# EAGLE design battery_charger (EAGLE 4.09)
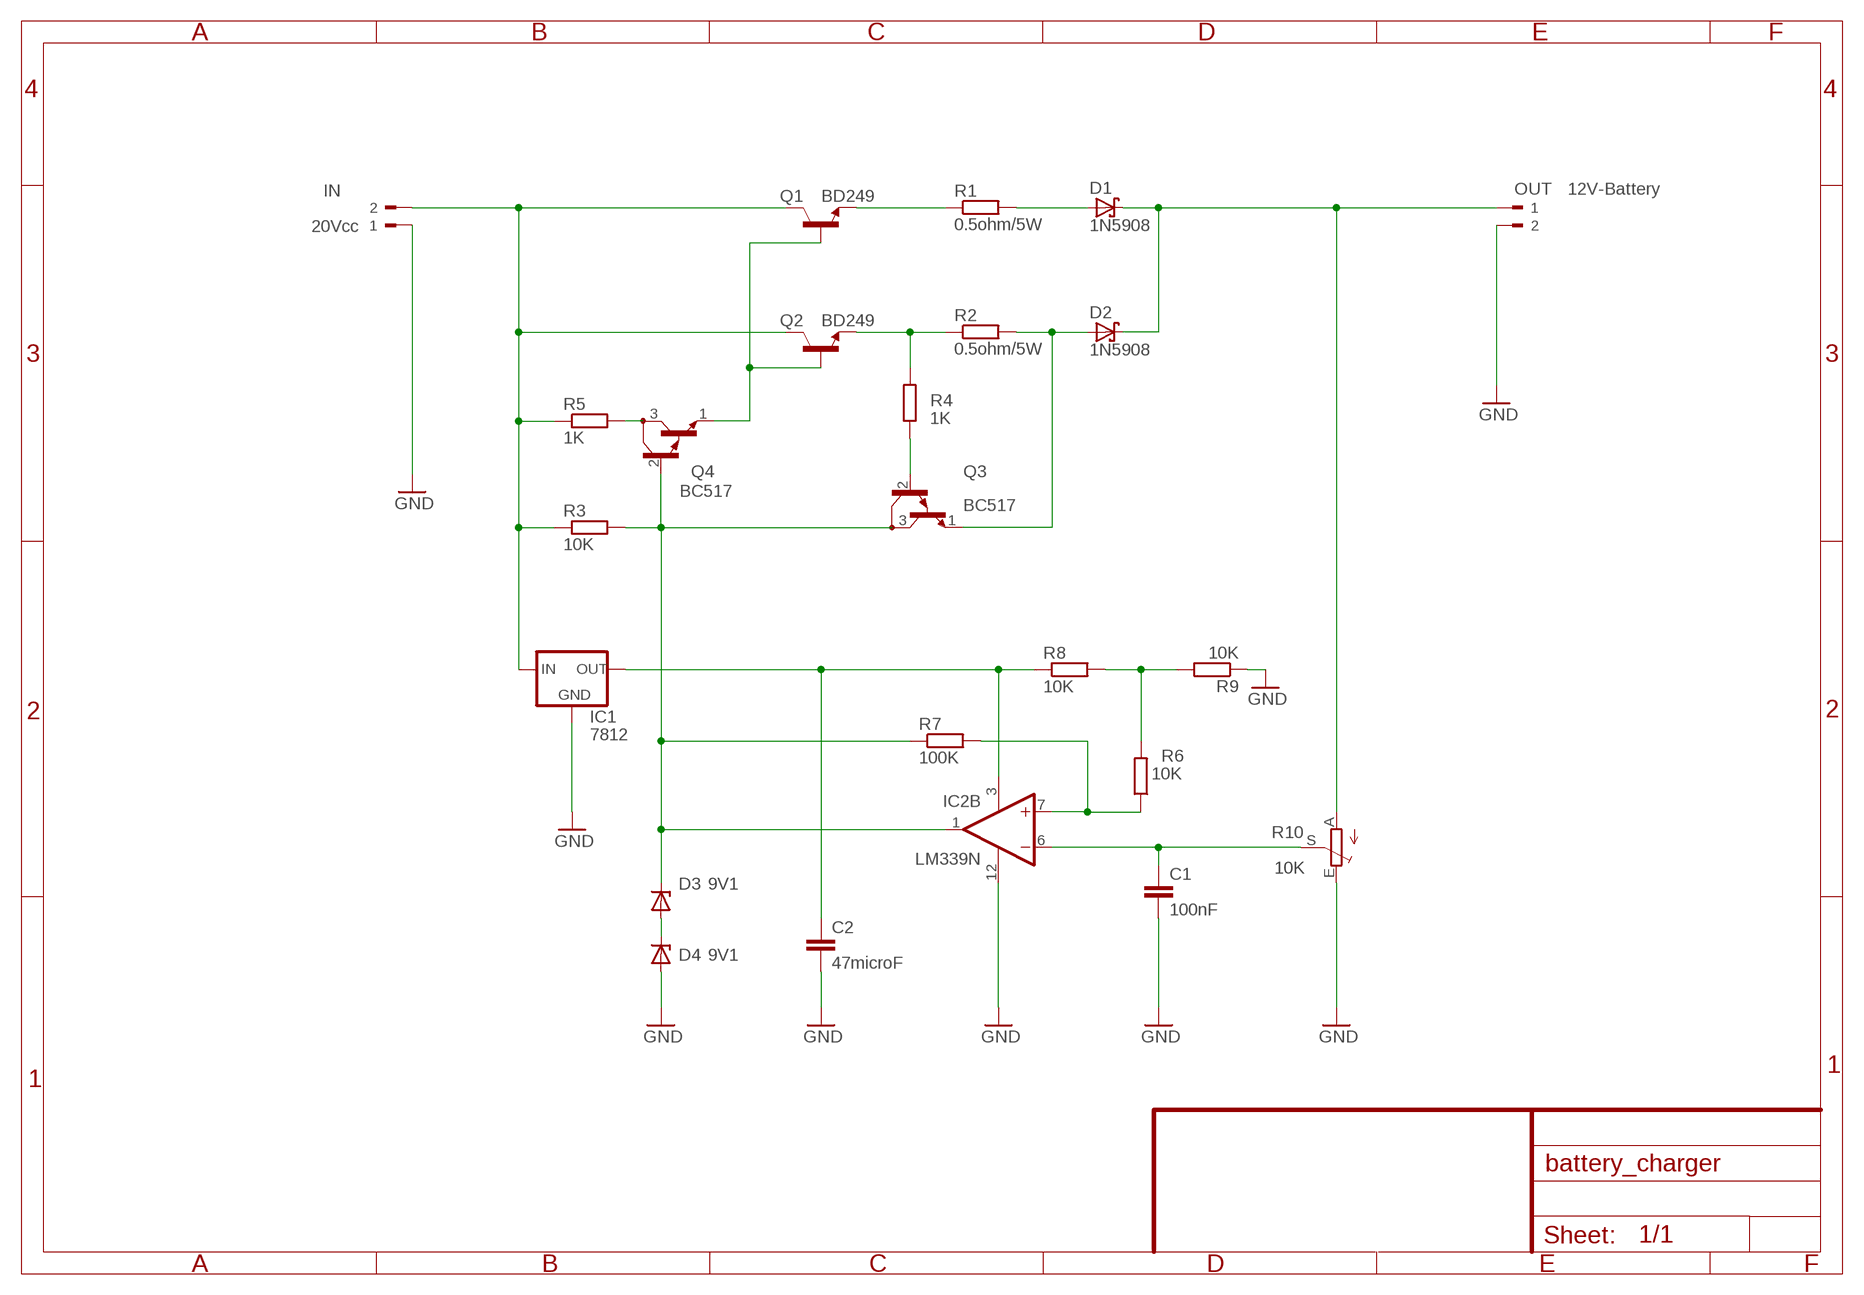
[diagram p0: schematic, sheet 1]

## Parts
C1  100nF  C-EU075-032X103  [C075-032X103]
C2  47microF  C-EU050-045X075  [C050-045X075]
D1  1N5908  [C4111-15]
D2  1N5908  [C4111-15]
D3  9V1  ZENER-DIODEDO34-7  [DO34Z7]
D4  9V1  ZENER-DIODEDO34-7  [DO34Z7]
IC1  7812  78XXS  [78XXS]
IC2  LM339N  [DIL14]
IN  20Vcc  90-2  [90-2]
OUT  12V-Battery  90-2  [90-2]
Q1  BD249  [TOP3]
Q2  BD249  [TOP3]
Q3  BC517  [TO92]
Q4  BC517  [TO92]
R1  0.5ohm/5W  R-EU_0922/22  [0922/22]
R2  0.5ohm/5W  R-EU_0922/22  [0922/22]
R3  10K  R-EU_0207/7  [0207/7]
R4  1K  R-EU_0207/7  [0207/7]
R5  1K  R-EU_0207/7  [0207/7]
R6  10K  R-EU_0207/7  [0207/7]
R7  100K  R-EU_0207/7  [0207/7]
R8  10K  R-EU_0207/7  [0207/7]
R9  10K  R-EU_0207/7  [0207/7]
R10  10K  TRIM_EU-LI15  [LI15]

## Nets
GND: C1.2 C2.2 D4.A IC1.GND IC2.12(P:V-) IN.1 OUT.2 R9.1 R10.E
N$1: Q1.3(E) R1.1
N$2: Q2.3(E) R2.1 R4.2
N$3: Q1.1(B) Q2.1(B) Q4.1(E)
N$4: IC1.IN IN.2 Q1.2(C) Q2.2(C) R3.1 R5.1
N$5: D1.A R1.2
N$6: D2.A Q3.1(E) R2.2
N$7: D1.C D2.C OUT.1 R10.A
N$8: Q3.2(B) R4.1
N$9: D3.C IC2.1(B:OUT) Q3.3(C) Q4.2(B) R3.2 R7.1
N$10: Q4.3(C) R5.2
N$11: IC2.7(B:+IN) R6.1 R7.2
N$12: C2.1 IC1.OUT IC2.3(P:V+) R8.1
N$13: R6.2 R8.2 R9.2
N$17: C1.1 IC2.6(B:-IN) R10.S
N$18: D3.A D4.C
Unconnected: IC2.2(A:OUT) IC2.4(A:-IN) IC2.5(A:+IN) IC2.8(C:-IN) IC2.9(C:+IN) IC2.10(D:-IN) IC2.11(D:+IN) IC2.13(D:OUT) IC2.14(C:OUT)

## Library data of the parts
C1 C2 = rcl:C-EU: CAPACITOR, European symbol
D1 D2 = diode:1N5908: DIODE schottky
D3 D4 = diode:ZENER-DIODE: Z-Diode
IC1 = v-reg:78XXS: VOLTAGE REGULATOR
IC2 = linear:LM339: COMPARATOR
IN OUT = con-weidmueller-sl35:90-2: WEIDMUELLER CLAMP CONNECTOR
Q1 Q2 = transistor-npn:BD249*: NPN Transistor
Q3 Q4 = transistor-npn:BC517*: NPN Darlington Transistor
R1-R9 = rcl:R-EU_: RESISTOR, European symbol
R10 = pot:TRIM_EU-: POTENTIOMETER

## Board
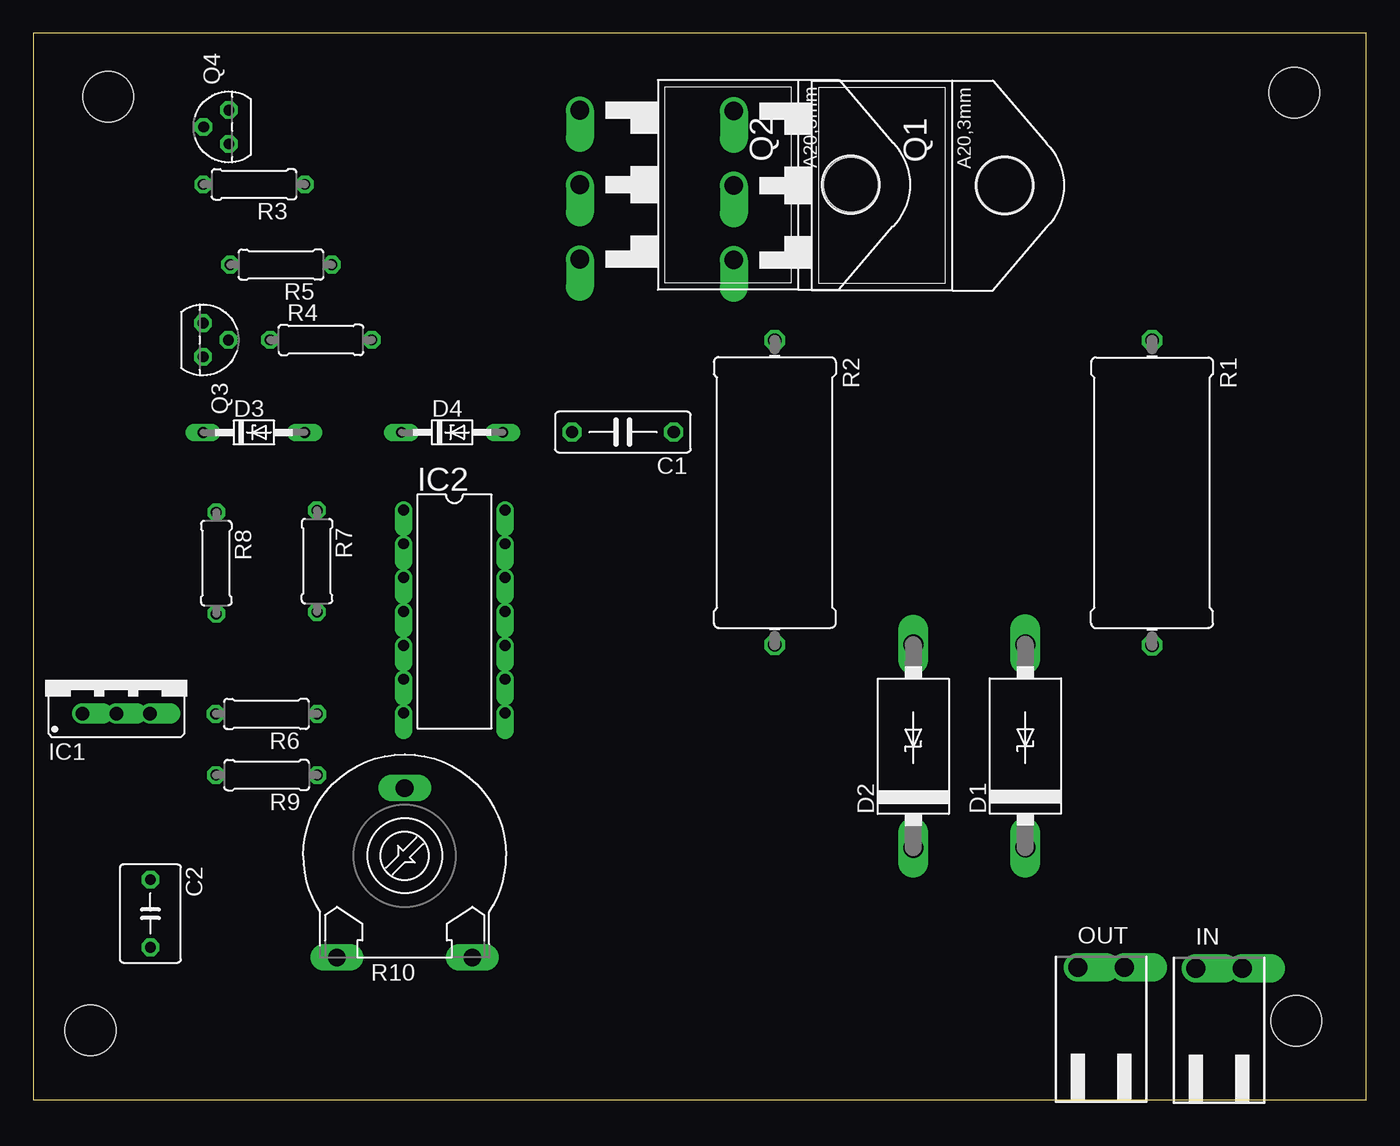
[diagram p1: board, top side]
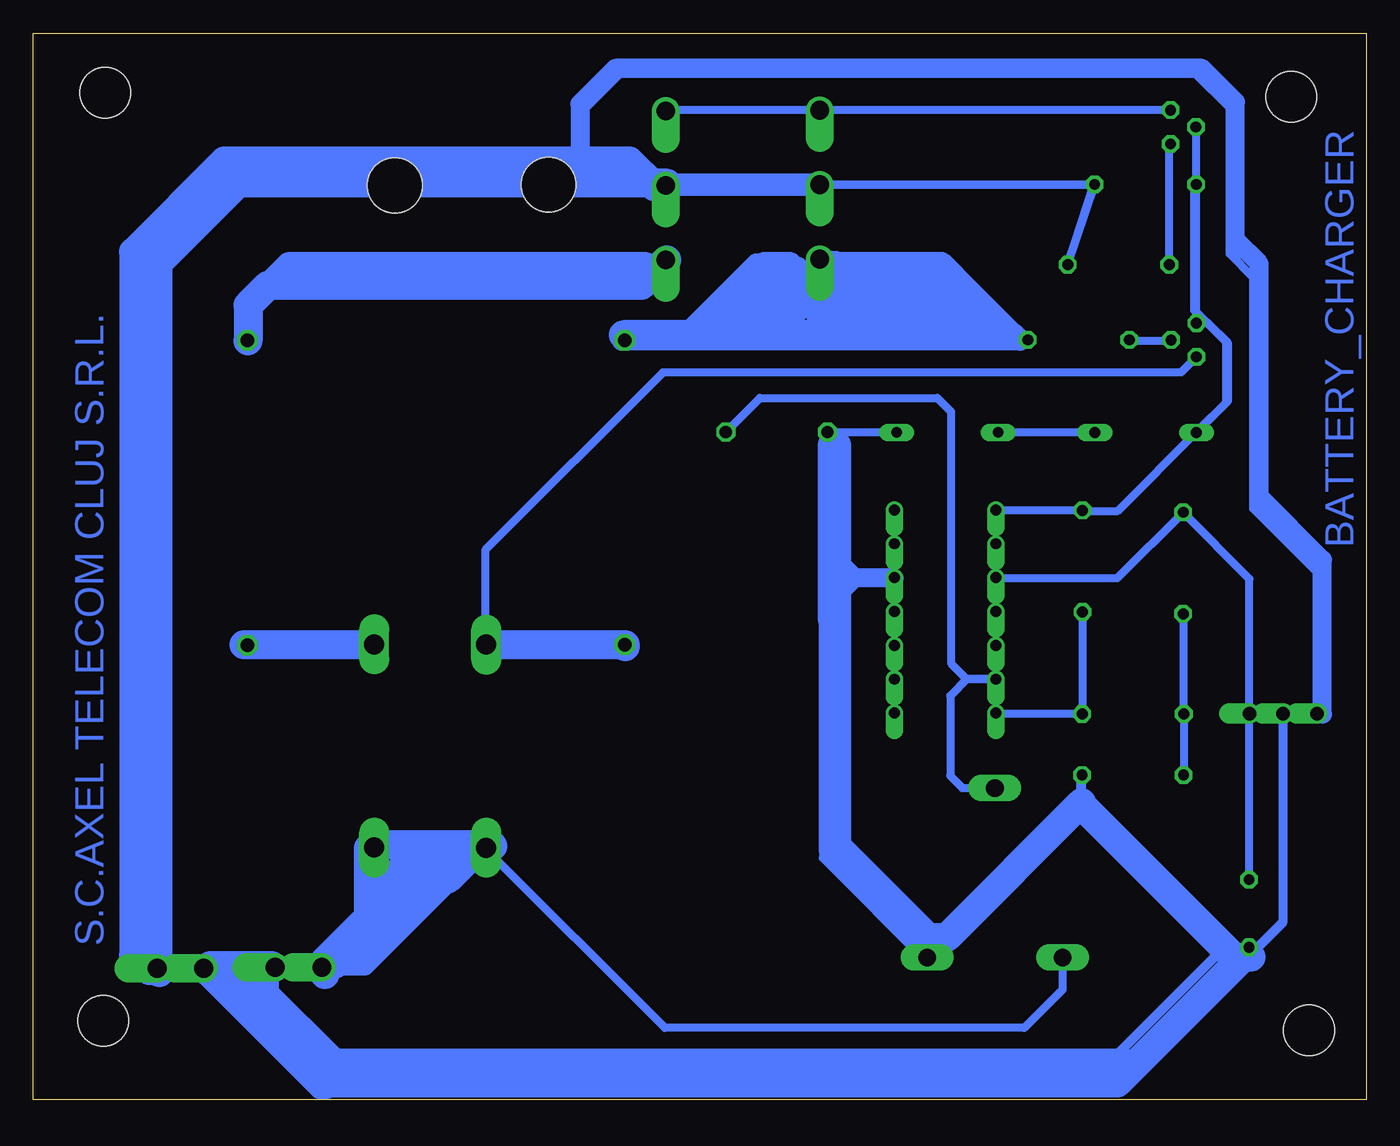
[diagram p2: board, bottom side, seen from below]

Size 100 x 80 mm. Coordinates in mm from the lower left corner, seen from the top.
Outline: 0,0 100,0 100,80 0,80 0,0
Copper layers used: Bottom
Holes 3.81 mm at 94.61,75.53 94.76,5.92 5.61,75.24 4.29,5.18

### Footprints (pad centres in the part's own frame; a part is rotated, then mirrored left to right if it is on the bottom)
C075-032X103 = drill 0.914 octagon: 1 -3.81,0; 2 3.81,0
C050-045X075 = drill 0.813 octagon: 1 -2.54,0; 2 2.54,0
C4111-15 = drill 1.499 long: A 7.62,0; C -7.62,0
DO34Z7 = drill 0.813 long: A 3.81,0; C -3.81,0
78XXS = drill 1.016 offset: GND 0,-2.54; IN -2.54,-2.54; OUT 2.54,-2.54
DIL14 = drill 0.813 offset: 1 -7.62,-3.81; 2 -5.08,-3.81; 3 -2.54,-3.81; 4 0,-3.81; 5 2.54,-3.81; 6 5.08,-3.81; 7 7.62,-3.81; 8 7.62,3.81; 9 5.08,3.81; 10 2.54,3.81; 11 0,3.81; 12 -2.54,3.81; 13 -5.08,3.81; 14 -7.62,3.81
90-2 = drill 1.422 offset: 1 -1.75,5.25; 2 1.75,5.25
TOP3 = drill 1.397 offset: 1 -5.588,-7.62; 2 0,-7.62; 3 5.588,-7.62 | hole 4.115: 0,12.7
TO92 = drill 0.813 octagon: 1 1.27,0; 2 0,1.905; 3 -1.27,0
0922/22 = drill 1.016 octagon: 1 -11.43,0; 2 11.43,0
0207/7 = drill 0.813 octagon: 1 -3.81,0; 2 3.81,0
LI15 = drill 1.321 long: A -5.08,-7.62; E 5.08,-7.62; S 0,5.08

### Placement (x,y rotation side)
C1  44.24,50.08 180 top
C2  8.78,13.96 270 top
D1  74.43,26.53 90 top
D2  66.02,26.51 90 top
D3  16.55,50.05 0 top
D4  31.42,50.06 0 top
IC1  6.22,31.5 0 top
IC2  31.59,36.62 270 top
IN  88.96,4.59 0 top
OUT  80.1,4.67 0 top
Q1  60.18,68.58 270 top
Q2  48.63,68.64 270 top
Q3  12.73,56.99 270 top
Q4  14.68,72.97 90 top
R1  83.93,45.52 270 top
R2  55.63,45.54 270 top
R3  16.56,68.67 180 top
R4  21.58,57 0 top
R5  18.58,62.64 180 top
R6  17.49,28.93 180 top
R7  21.28,40.39 270 top
R8  13.73,40.25 270 top
R9  17.5,24.34 180 top
R10  27.86,18.28 0 top

### Tracks (layer width: path | path; a pad name or v marks a point on that pad's centre or on a via)
GND
  Bottom 0.61: 40.47,49.97 40.43,50.01 | 40.43,50.01 C1.2 40.43,41.77 37.85,39.19 35.59,39.19 35.52,39.25 35.43,39.16 IC2.12 39.28,39.16 40.77,37.67 40.77,18.11 32.92,10.26 21.32,21.86 21.32,24.34 R9.1 21.31,21.91 32.88,10.35 32.94,10.41 R10.E 32.22,10.66 21.66,21.22 21.21,21.22 10.99,11 8.62,11 6.25,13.37 6.25,28.78 6.4,28.93 6.37,28.96 IC1.GND 6.22,13.25 8.77,10.71 11.29,10.71 20.62,1.37 76.62,1.37 81.96,6.71 81.96,10.26 81.85,10.37 | D4.A 40.38,50.06 40.43,50.01 | C2.2 11.26,11.42 21.47,21.63 | 21.47,24.25 21.47,21.63 | 21.47,21.63 11.29,11.45 11.29,10.85 20.32,1.81 76.93,1.81 81.84,6.73 81.84,9.82 81.78,9.89 81.81,9.92 OUT.2 | 87.43,9.92 87.35,9.84 IN.1 | OUT.2 87.43,9.92 | 87.43,9.92 | 81.81,10.41 81.85,10.37 | 81.85,10.37 OUT.2
N$1
  Bottom 0.61: Q1.3 54.17,61.38 82.11,61.38 82.4,61.08 | 83.89,56.78 83.89,56.91 | 83.89,56.91 R1.1 | 83.89,56.93 83.89,56.91
  Bottom 2.184: 52.48,63.01 54.4,61.08 82.4,61.08 83.89,59.6 83.89,56.93
N$2
  Bottom 0.61: R4.2 55.59,56.93 | Q2.3 41.07,56.93 55.59,56.93 | 55.59,56.93 R2.1
N$3
  Bottom 0.61: 41.2,74.13 41.1,74.23 | 41.1,74.23 Q2.1 52.93,74.23 | Q4.1 41.09,74.24 41.1,74.23 | 52.93,74.23 52.87,74.17 Q1.1 | 52.93,74.23 52.99,74.29
N$4
  Bottom 0.61: Q2.2 40.92,68.64 R3.1 20.44,68.65 R5.1 22.45,62.57 20.38,68.65 20.39,68.64 41.06,68.64 41.18,68.52 56.35,68.52 58.85,71.01 58.85,74.12 56.03,76.93 12.77,76.93 10.25,74.41 10.25,63.45 8.47,61.67 8.47,44.34 3.68,39.55 IC1.IN | IN.2 90.71,62.55 84.48,68.78 52.18,68.78 52.38,68.58 Q1.2
  Bottom 1.676: Q1.2 52.48,68.49 52.32,68.64 Q2.2
N$5
  Bottom 0.61: D1.A 74.4,34.12 83.91,34.12 R1.2
  Bottom 2.184: 74.4,34.12 84.18,34.12
N$6
  Bottom 0.61: Q3.1 13.89,54.56 52.77,54.56 66.11,41.23 66.11,34.12 66.11,34.05 | 66.11,33.97 66.11,34.05 | 66.11,34.05 D2.A 66.01,34.12 R2.2 | 55.44,34.12 R2.2 | R2.2
  Bottom 2.184: 55.59,33.97 55.59,34.12 66.11,34.12
N$7
  Bottom 0.61: R10.A 22.78,8.25 25.66,5.37 52.62,5.37 66.11,18.85 66.07,18.89 D2.C 74.52,18.89 | 74.52,18.89 74.5,18.9 D1.C 74.43,13.79 78.35,9.87 | 74.52,18.89 74.7,18.71 | 78.4,9.82 78.35,9.87 | 78.35,9.87 OUT.1
N$8
  Bottom 0.61: 17.92,56.91 17.77,56.91 | 17.77,56.91 R4.1 | Q3.2 14.64,56.91 17.77,56.91
N$9
  Bottom 0.61: D3.C 10.35,52.44 10.35,56.75 11.87,58.27 12.82,58.27 12.82,58.26 Q3.3 12.73,73.1 12.77,73.1 Q4.2 12.79,72.97 12.82,72.94 12.75,72.86 R3.2 12.75,68.78 | 21.11,44.24 21.14,44.2 R7.1 | 21.11,44.24 IC2.1 21.43,44.24 21.35,44.16 18.64,44.16 12.58,50.22 | 21.11,44.24 21.03,44.32 | 12.58,50.22 | 12.58,50.22 10.51,52.29 10.51,56.83 12.9,59.23 12.9,68.63 12.75,68.78 | 12.74,68.79 12.75,68.78
N$10
  Bottom 0.61: Q4.3 14.68,71.74 14.77,71.74 R5.2
N$11
  Bottom 0.61: 21.35,28.85 21.3,28.85 | 21.3,28.85 R6.1 27.78,28.93 | R7.2 21.28,28.85 21.3,28.85 | 27.89,28.93 27.78,28.93 | 27.78,28.93 IC2.7
N$12
  Bottom 0.61: 8.71,29 8.76,29 | 8.76,29 IC1.OUT 8.76,39.07 13.73,44.04 R8.1 18.69,39.1 27.84,39.1 | C2.1 8.78,29 8.76,29 | 27.9,39.1 27.84,39.1 | 27.84,39.1 IC2.3
N$13
  Bottom 0.61: 13.84,23.98 13.7,23.98 | 13.7,23.98 R9.2 | 13.7,23.98 13.69,23.98 13.69,28.68 13.73,28.68 R8.2 13.73,28.77 13.68,28.77 R6.2
N$14
  Bottom 2.184: 52.43,68.75 84.68,68.75 90.67,62.76 90.67,9.63 90.55,9.52
N$15
  Bottom 2.184: 40.92,62.86 40.92,57.38 55.73,57.38
N$16
  Bottom 2.184: 78.11,9.37 78.11,10.41 74.85,13.67 74.85,18.85 74.55,19.15 65.66,19.15 65.51,19
N$17
  Bottom 0.61: C1.1 45.49,52.64 32.18,52.64 31.15,51.61 31.15,32.73 29.99,31.57 27.75,31.57 | 27.67,31.57 27.75,31.57 | 27.75,31.57 IC2.6 29.96,31.54 31.21,30.29 31.21,24.29 30.29,23.38 27.79,23.38 27.77,23.36 | 27.73,23.32 27.77,23.36 | 27.77,23.36 R10.S
N$18
  Bottom 0.61: 27.73,50.06 D4.C | D4.C | D3.A D4.C
N$19
  Bottom 2.184: 53.22,68.49 53.36,68.49 55.29,70.41 85.66,70.41 92.48,63.6 92.48,10.85 91.29,9.67
N$20
  Bottom 2.184: 8.62,10.71 9.21,10.71 18.69,1.22 77.37,1.22 84.48,8.33 84.48,9.22 82.7,9.22
N$21
  Bottom 2.184: 17.95,2.7 78.4,2.7 78.7,3
N$22
  Bottom 2.184: 39.73,49.08 39.73,19 32.92,12.19 31.44,12.19 21.36,22.26 21.36,22.11 9.8,10.56
N$23
  Bottom 2.184: 40.05,36.07 40.05,49.09 39.99,49.14
N$24
  Bottom 2.184: 39.99,36.5 39.99,18.72 39.89,18.62
N$25
  Bottom 1.422: 3.29,28.93 3.29,40.49 8.03,45.23 8.03,62.71 9.8,64.49 9.8,74.86 12.32,77.38 56.33,77.38 58.99,74.71 58.99,69.97 59.14,69.82
N$26
  Bottom 1.422: 25.96,56.89 55.84,56.89 55.88,56.93
N$27
  Bottom 1.422: 28.66,57.29 38.6,57.29 40.31,59 30.41,59 28.62,57.21 37.13,57.21 38.28,58.37 31.33,58.37 31.05,58.09 31.05,59.08 30.77,59.36 37.49,59.36 41.11,62.98 41.11,61.51 39.16,59.56 39.16,61.39 40.75,62.98 39.8,62.98 36.89,60.08 30.65,60.08 28.14,57.57 26.43,57.57 26.08,57.21 26.12,57.21 30.93,62.02 40.07,62.02 40.95,62.9 31.84,62.9 29.62,60.67 36.81,60.67 37.29,61.15 40.51,61.15 43.77,57.89 43.77,59.84 42.1,61.51 42.1,61.39 45.92,57.57 45.92,59.2 42.62,62.5 44.17,62.5 48.98,57.69 47.47,57.69 46.67,58.48 46.67,59.76 45.6,60.83 45.16,60.83 43.14,62.86 45.28,62.86 49.58,58.56 49.98,58.56 51.41,57.13 | 51.41,57.13 | 51.41,57.13 45.76,62.78 45.76,60.67 48.82,57.61
N$28
  Bottom 1.422: 53.96,62.86 80.92,62.86 84.18,59.6
N$29
  Bottom 1.422: 66.03,18.92 68.09,18.92 77.2,9.81 77.2,11.28 70.37,18.11 72.13,18.11 73.89,16.35 68.53,16.35 66.25,18.62 67.43,18.62 69.08,16.97 69.08,16.53 68.75,16.2 68.94,16.2 75.14,9.99 78.38,9.99 78.48,9.88
N$30
  Bottom 1.422: 87.43,9.61 87.24,9.61 85.72,8.09 85.72,8.87 85.56,9.02 85.83,9.02 85.99,9.18
N$31
  Bottom 1.422: 77.05,2.89 77.09,2.89 82.63,8.44
N$32
  Bottom 1.422: 81.97,10.39 86.89,10.39 87.12,10.16 87.12,9.33 78.53,0.75 77.99,0.75 77.95,0.79
N$33
  Bottom 1.422: 35.39,39.11 39.62,39.11
N$34
  Bottom 1.422: 39.54,37.19 39.54,38.01 38.67,38.88
(copper drawn outside any net)
  shapes: Bottom area x1

### Text on the board
Bottom: BATTERY_CHARGER | S.C.AXEL TELECOM CLUJ S.R.L.